# EasyEDA schematic IN OUT.json
TITLE: TRICORE | ALU | LOGIC; REV: 1.0; Date: 2022-01-03; Sheet: 1/9; Drawn By: Koehler, Paul; Company: komed3
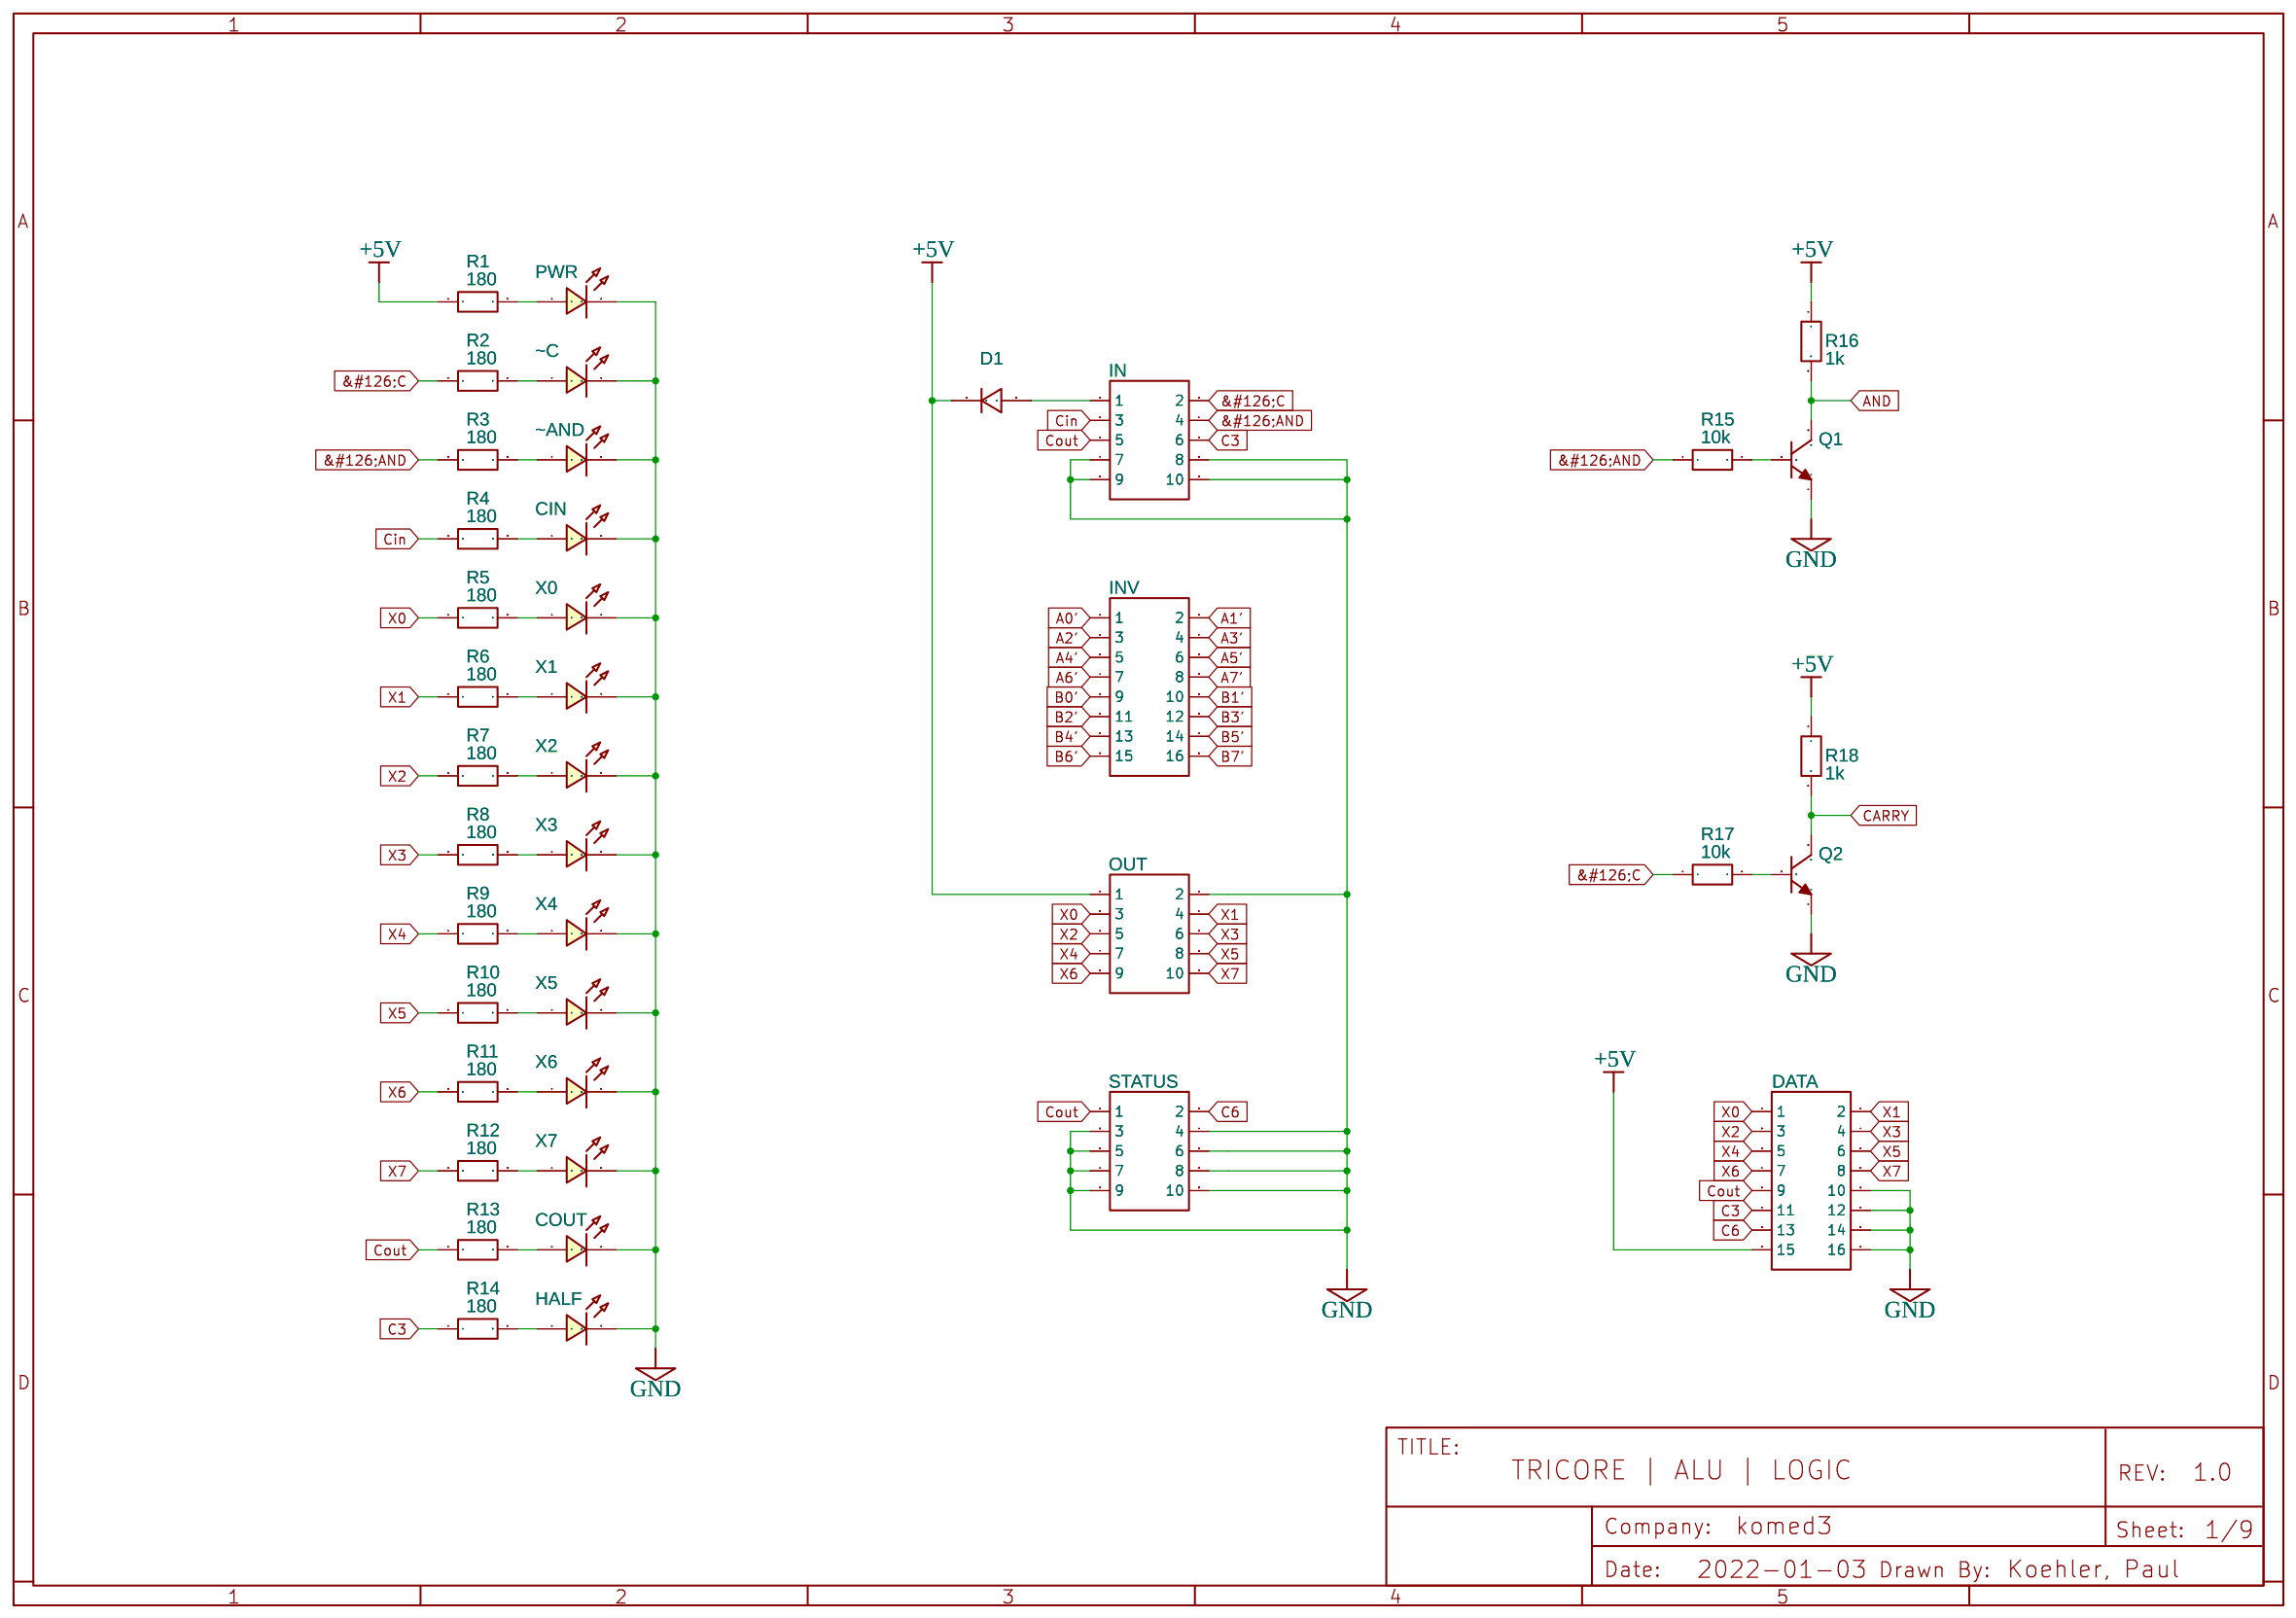
[diagram p0: schematic sheet]

## Parts
&#126;AND  LED-TH-5mm_R  [LED-TH_BD5.0_RED]
&#126;C  LED-TH-5mm_R  [LED-TH_BD5.0_RED]
CIN  LED-TH-5mm_R  [LED-TH_BD5.0_RED]
COUT  LED-TH-5mm_R  [LED-TH_BD5.0_RED]
D1  1N4007  [DO-41_BD2.4-L4.7-P8.70-D0.9-RD]
DATA  HDR-M-2.54_2x8  [HDR-M-2.54_2X8]
HALF  LED-TH-5mm_R  [LED-TH_BD5.0_RED]
IN  HDR-IDC-2.54-2X5P  [IDC-TH_10P-P2.54_C5665]
INV  HDR-IDC-2.54-2X8P  [IDC-TH_16P-P2.54_C3406]
OUT  HDR-IDC-2.54-2X5P  [IDC-TH_10P-P2.54_C5665]
PWR  LED-TH-5mm_R  [LED-TH_BD5.0_RED]
Q1  2N3904(TO-92)  [TO-92-3_L5.1-W4.1-P1.27-L]
Q2  2N3904(TO-92)  [TO-92-3_L5.1-W4.1-P1.27-L]
R1  180  [0.25W-RESISTOR-VERTICAL]
R2  180  [0.25W-RESISTOR-VERTICAL]
R3  180  [0.25W-RESISTOR-VERTICAL]
R4  180  [0.25W-RESISTOR-VERTICAL]
R5  180  [0.25W-RESISTOR-VERTICAL]
R6  180  [0.25W-RESISTOR-VERTICAL]
R7  180  [0.25W-RESISTOR-VERTICAL]
R8  180  [0.25W-RESISTOR-VERTICAL]
R9  180  [0.25W-RESISTOR-VERTICAL]
R10  180  [0.25W-RESISTOR-VERTICAL]
R11  180  [0.25W-RESISTOR-VERTICAL]
R12  180  [0.25W-RESISTOR-VERTICAL]
R13  180  [0.25W-RESISTOR-VERTICAL]
R14  180  [0.25W-RESISTOR-VERTICAL]
R15  10k  [0.25W-RESISTOR-VERTICAL]
R16  1k  [0.25W-RESISTOR-VERTICAL]
R17  10k  [0.25W-RESISTOR-VERTICAL]
R18  1k  [0.25W-RESISTOR-VERTICAL]
STATUS  HDR-IDC-2.54-2X5P  [IDC-TH_10P-P2.54_C5665]
X0  LED-TH-5mm_R  [LED-TH_BD5.0_RED]
X1  LED-TH-5mm_R  [LED-TH_BD5.0_RED]
X2  LED-TH-5mm_R  [LED-TH_BD5.0_RED]
X3  LED-TH-5mm_R  [LED-TH_BD5.0_RED]
X4  LED-TH-5mm_R  [LED-TH_BD5.0_RED]
X5  LED-TH-5mm_R  [LED-TH_BD5.0_RED]
X6  LED-TH-5mm_R  [LED-TH_BD5.0_RED]
X7  LED-TH-5mm_R  [LED-TH_BD5.0_RED]
~AND  LED-TH-5mm_R
~C  LED-TH-5mm_R

## Library data of the parts
&#126;AND &#126;C CIN COUT HALF PWR X0-X7 = LED-TH-5mm_R: Manufacturer: EVERLIGHT(台湾亿光); Manufacturer Part: 333-2SURD/S530-A3; Supplier Part: C87271; Supplier: LCSC; Contributor: LCEDA_Lib
D1 = 1N4007: Supplier: LCSC; Manufacturer: SEMTECH; Supplier Part: C106903; Contributor: LCEDA_Lib
DATA = HDR-M-2.54_2x8: Supplier Part: C68234; Supplier: LCSC; Contributor: LCEDA_Lib
IN OUT STATUS = HDR-IDC-2.54-2X5P: Supplier: LCSC; Manufacturer: BOOMELE; Manufacturer Part: IDC Box 2.54mm 2X5P; image: //image.lceda.cn/szlcsc/C5665.jpg; Supplier Part: C5665
INV = HDR-IDC-2.54-2X8P: Supplier: LCSC; Manufacturer: BOOMELE; Manufacturer Part: IDC Box 2.54mm 16P　Straight; image: //image.lceda.cn/szlcsc/C3406.jpg; Supplier Part: C3406
Q1 Q2 = 2N3904(TO-92): Supplier: LCSC; Manufacturer: SEMTECH; Manufacturer Part: 2N3904; Supplier Part: C118538; Contributor: LCEDA_Lib
R1-R18 = R_AXIAL-0.3_EU: Contributor: LCEDA_Lib
~AND = LED-TH-5mm_R_2: BOM_Manufacturer Part: 333-2SURD/S530-A3; BOM_Manufacturer: EVERLIGHT(台湾亿光); BOM_Supplier Part: C87271; BOM_Supplier: LCSC
~C = LED-TH-5mm_R_1: BOM_Manufacturer Part: 333-2SURD/S530-A3; BOM_Manufacturer: EVERLIGHT(台湾亿光); BOM_Supplier Part: C87271; BOM_Supplier: LCSC

## Nets
+5V: D1.1 DATA.15 OUT.1 R1.1 R16.1 R18.1
GND: &#126;AND.2 &#126;C.2 CIN.2 COUT.2 DATA.10 DATA.12 DATA.14 DATA.16 HALF.2 IN.7 IN.8 IN.9 IN.10 OUT.2 PWR.2 Q1.1(E) Q2.1(E) STATUS.3 STATUS.4 STATUS.5 STATUS.6 STATUS.7 STATUS.8 STATUS.9 STATUS.10 X0.2 X1.2 X2.2 X3.2 X4.2 X5.2 X6.2 X7.2
&#126;AND: IN.4 R3.1 R15.1
&#126;C: IN.2 R2.1 R17.1
A0': INV.1
A1': INV.2
A2': INV.3
A3': INV.4
A4': INV.5
A5': INV.6
A6': INV.7
A7': INV.8
AND: Q1.3(C) R16.2
B0': INV.9
B1': INV.10
B2': INV.11
B3': INV.12
B4': INV.13
B5': INV.14
B6': INV.15
B7': INV.16
C3: DATA.11 IN.6 R14.1
C6: DATA.13 STATUS.2
CARRY: Q2.3(C) R18.2
Cin: IN.3 R4.1
Cout: DATA.9 IN.5 R13.1 STATUS.1
X0: DATA.1 OUT.3 R5.1
X1: DATA.2 OUT.4 R6.1
X2: DATA.3 OUT.5 R7.1
X3: DATA.4 OUT.6 R8.1
X4: DATA.5 OUT.7 R9.1
X5: DATA.6 OUT.8 R10.1
X6: DATA.7 OUT.9 R11.1
X7: DATA.8 OUT.10 R12.1
Net-(&#126;AND-1): &#126;AND.1 R3.2
Net-(&#126;C-1): &#126;C.1 R2.2
Net-(CIN-1): CIN.1 R4.2
Net-(COUT-1): COUT.1 R13.2
Net-(D1-2): D1.2 IN.1
Net-(HALF-1): HALF.1 R14.2
Net-(PWR-1): PWR.1 R1.2
Net-(Q1-2): Q1.2(B) R15.2
Net-(Q2-2): Q2.2(B) R17.2
Net-(R5-2): R5.2 X0.1
Net-(R6-2): R6.2 X1.1
Net-(R7-2): R7.2 X2.1
Net-(R8-2): R8.2 X3.1
Net-(R9-2): R9.2 X4.1
Net-(R10-2): R10.2 X5.1
Net-(R11-2): R11.2 X6.1
Net-(R12-2): R12.2 X7.1
